# Altium schematic sheet TPcape_ultra.SchDoc
size A3
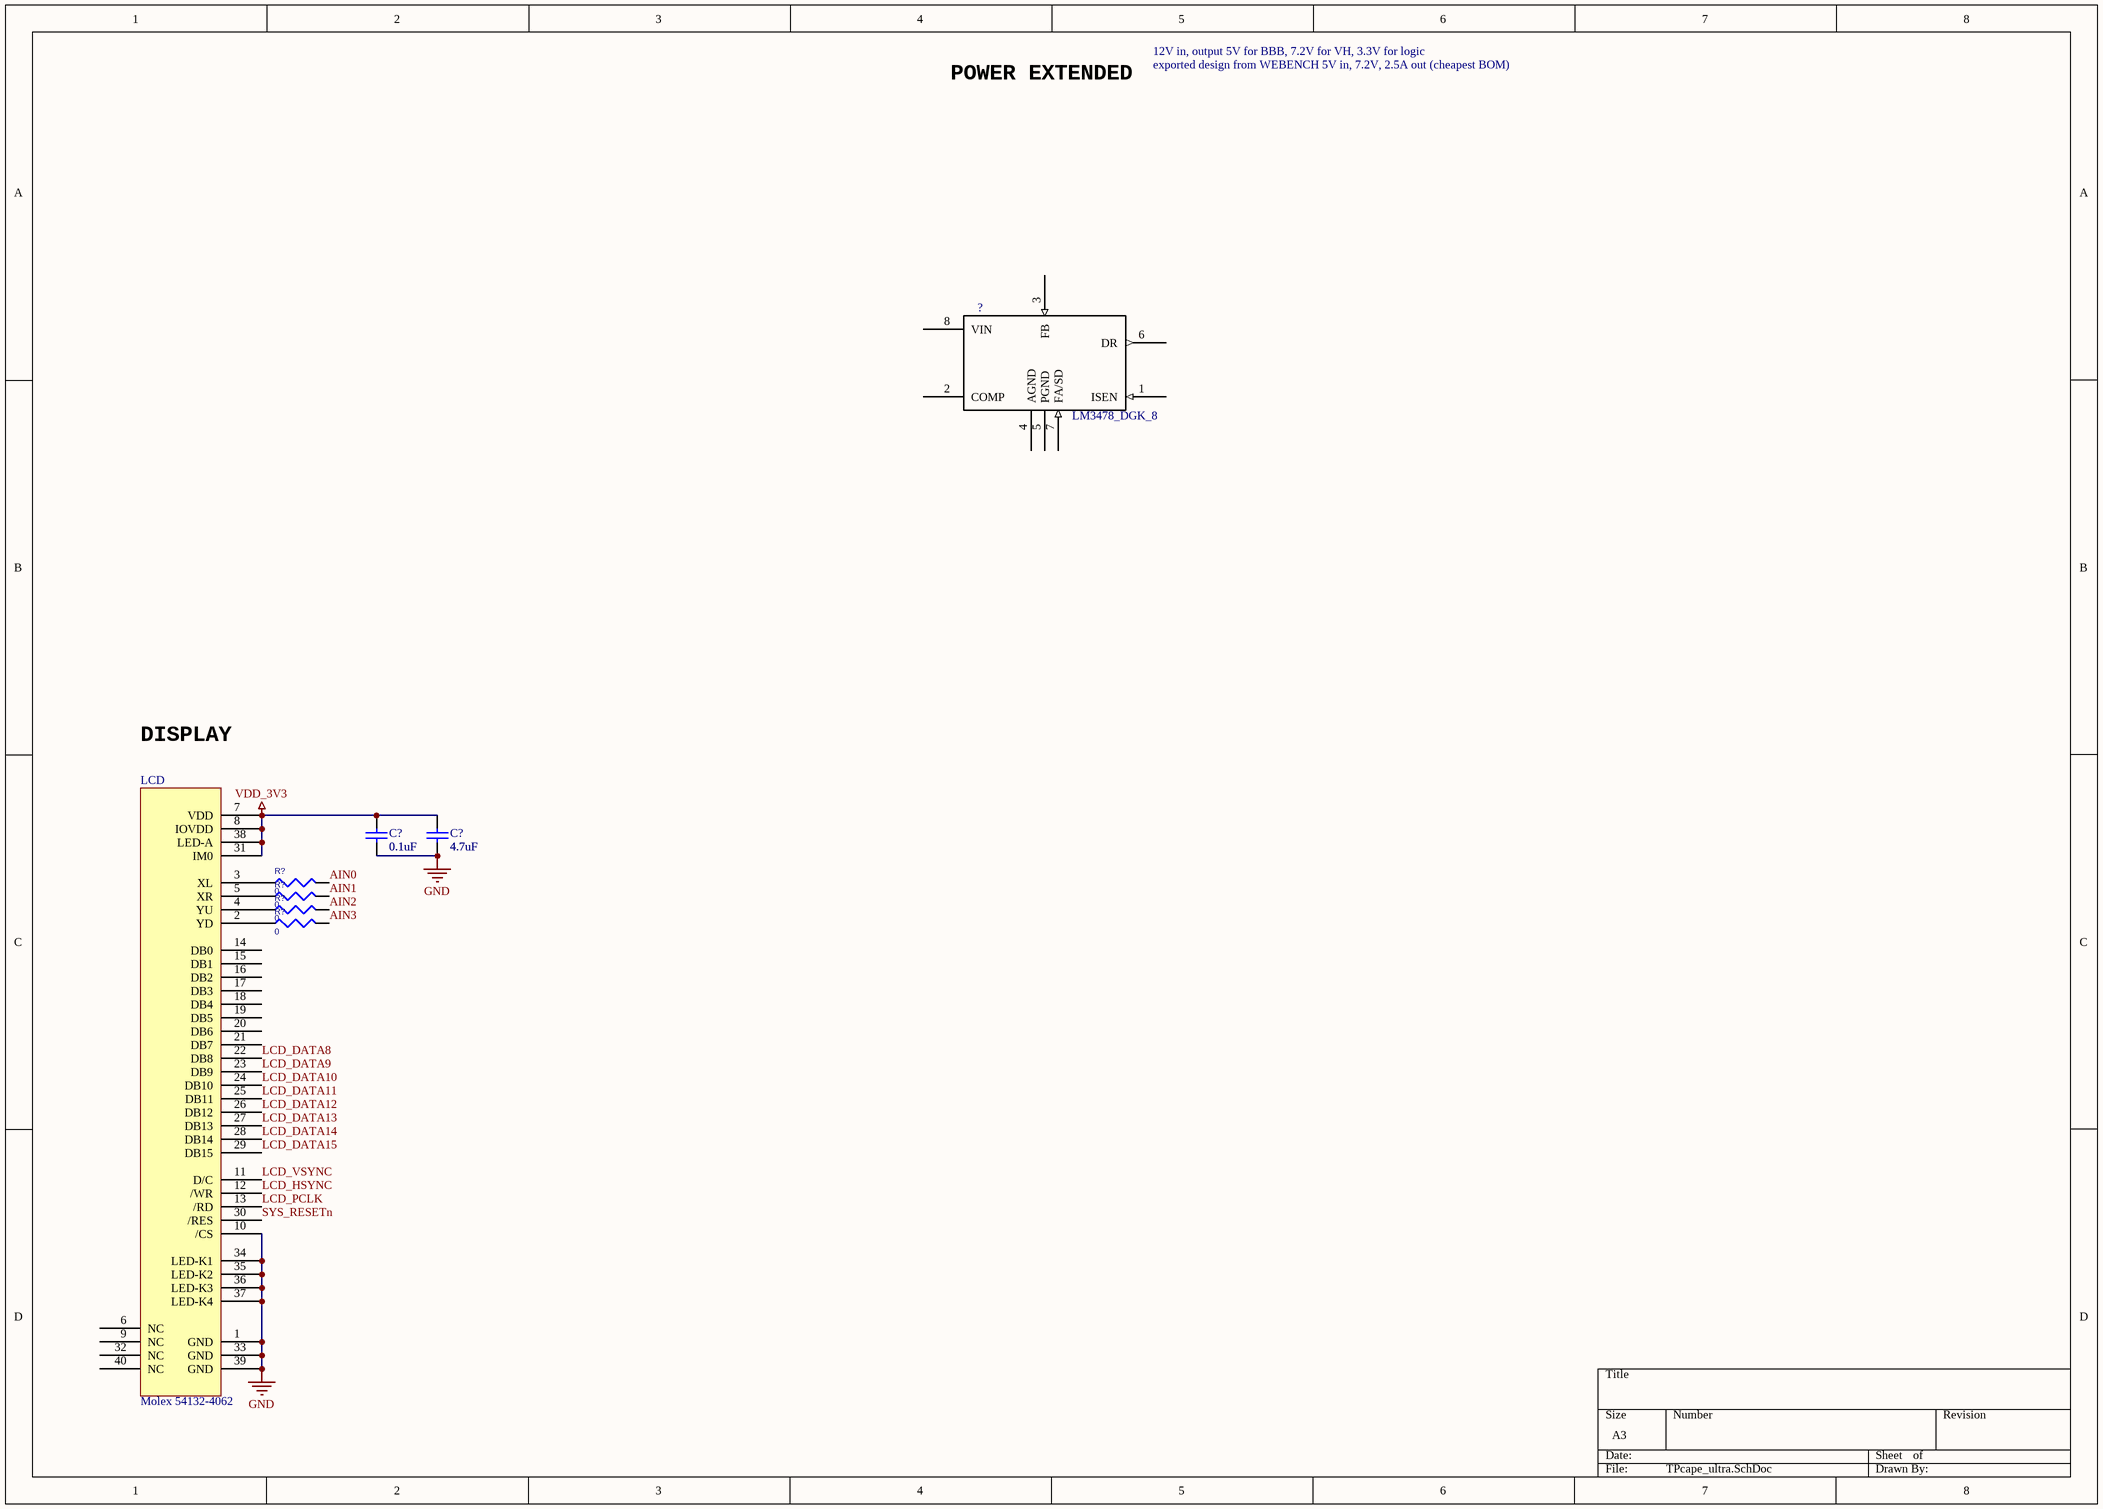
[diagram p0: TPcape_ultra.SchDoc]

## Parts
(Parts that share a designator on the sheet are numbered #1, #2 ... from top to bottom, then left to right.)
?  LM3478_DGK_8  [MUA08A]
C?#1  0.1uF  [0402]
C?#2  4.7uF  [C1206]
LCD  Molex 54132-4062  [Molex 54132-4062]
R?#1  0  [402]
R?#2  0  [402]
R?#3  0  [402]
R?#4  0  [402]

## Nets
GND: C?#1.1 C?#2.1 LCD.1(GND) LCD.10(/CS) LCD.33(GND) LCD.34(LED-K1) LCD.35(LED-K2) LCD.36(LED-K3) LCD.37(LED-K4) LCD.39(GND)
VDD_3V3: C?#1.2 C?#2.2 LCD.7(VDD) LCD.8(IOVDD) LCD.31(IM0) LCD.38(LED-A)
AIN0: R?#1.1(P1)
AIN1: R?#2.1(P1)
AIN2: R?#3.1(P1)
AIN3: R?#4.1(P1)
LCD_DATA8: LCD.22(DB8)
LCD_DATA9: LCD.23(DB9)
LCD_DATA10: LCD.24(DB10)
LCD_DATA11: LCD.25(DB11)
LCD_DATA12: LCD.26(DB12)
LCD_DATA13: LCD.27(DB13)
LCD_DATA14: LCD.28(DB14)
LCD_DATA15: LCD.29(DB15)
LCD_HSYNC: LCD.12(/WR)
LCD_PCLK: LCD.13(/RD)
LCD_VSYNC: LCD.11(D/C)
SYS_RESETn: LCD.30(/RES)
NetLCD_2: LCD.2(YD) R?#4.2(P2)
NetLCD_3: LCD.3(XL) R?#1.2(P2)
NetLCD_4: LCD.4(YU) R?#3.2(P2)
NetLCD_5: LCD.5(XR) R?#2.2(P2)

Not connected (* = marked no-connect by the designer): ? 1(ISEN) 2(COMP) 3(FB) 4(AGND) 5(PGND) 6(DR) 7(FA/SD) 8(VIN); LCD 6(NC) 9(NC) 14(DB0) 15(DB1) 16(DB2) 17(DB3) 18(DB4) 19(DB5) 20(DB6) 21(DB7) 32(NC) 40(NC)

## Notes on the sheet
- POWER EXTENDED
- 12V in, output 5V for BBB, 7.2V for VH, 3.3V for logic
- exported design from WEBENCH 5V in, 7.2V, 2.5A out (cheapest BOM)
- DISPLAY

## Library data of the parts
? = LM3478_DGK_8: Imported; Manufacturer_Part_Number: lm3478mmnopb; Vendor: National; RefDes: RefDes; Type: DEV; Value: Value
C?#1 C?#2 = Cap Semi: Capacitor (Semiconductor SIM Model); Published: 8-Jun-2000; LatestRevisionDate: 29-May-2009; LatestRevisionNote: IPC-7351 Footprint Added.; PackageReference: C1206; Publisher: Altium Limited; PackageDescription: Chip Capacitor
  C?#1: Value: 0.1uF
  C?#2: Value: 4.7uF
LCD = Molex 54132-4062: FPC connector for NHD-2.4" LCD (specifically NHD-2.4-240320SF-CTXL#-FTN1)
R?#1-R?#4 = RES SMD: RES 10K OHM 1/16W 5% 0402 SMD; Manufacturer: Rohm Semiconductor; Manufacturer Part Number: MCR01MZPJ103; Power (Watts): 0.063W, 1/16W; Temperature Coefficient: ±200ppm/°C; Supplier 1: Digi-Key; Supplier Part Number 1: RHM10KJDKR-ND; RoHS: RoHS Compliant; Category: Resistors; Stock 1: 452072; Pricing 1: 1=0.1, 10=0.019, 25=0.014, 100=0.0078, 250=0.00596, 500=0.00476, 1000=0.0035, 5000=0.00251 (USD); Resistance (Ohms): 0; Composition: Thick Film; Features: Automotive AEC-Q200 Qualified; Tolerance: ±5%; Package / Case: 0402 (1005 Metric); Supplier Device Package: 0402 (1005 Metric); Size / Dimension: 0.039" L x 0.020" W (1.00mm x 0.50mm); Height: 0.016" (0.40mm); Number of Terminations: 2; Packaging: Digi-Reel®; ComponentLink1URL: http://rohmfs.rohm.com/en/products/databook/datasheet/passive/resistor/chip_resistor/mcr_a.pdf; ComponentLink1Description: http://rohmfs.rohm.com/en/products/databook/datasheet/passive/resistor/chip_resistor/mcr_a.pdf